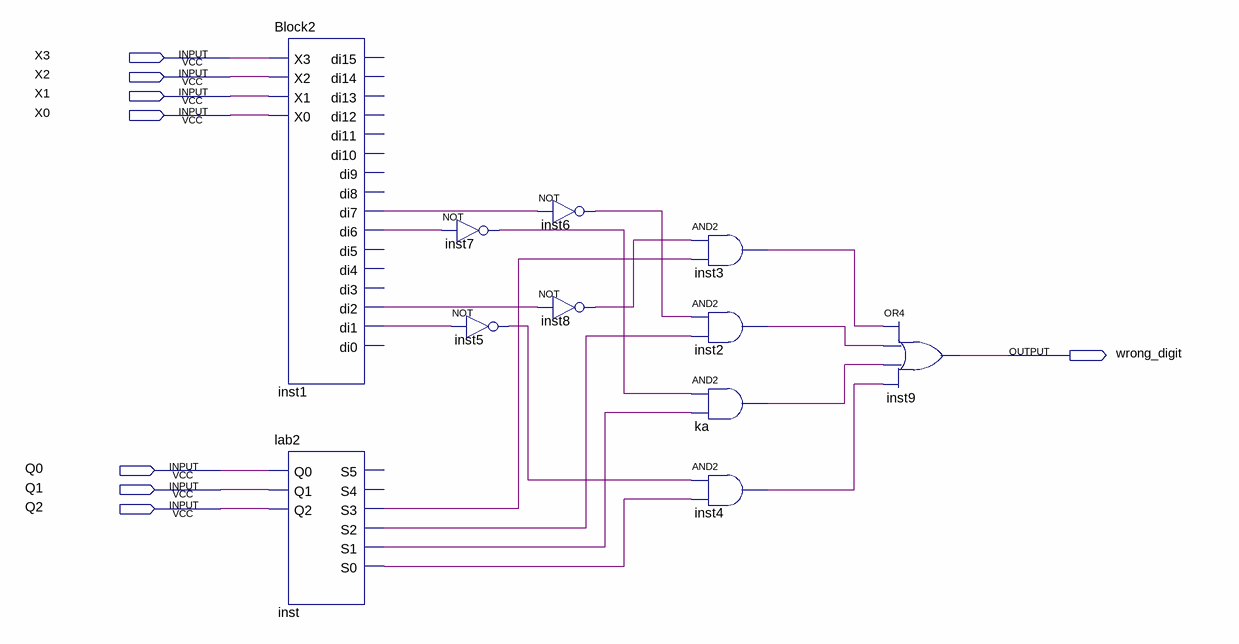
[diagram p0: schematic sheet]
// Quartus schematic Block3.bdf as structural Verilog: 11 symbols, 8 pins
module Block3 (
  input  X3,
  input  X2,
  input  X1,
  input  X0,
  input  Q0,
  input  Q1,
  input  Q2,
  output wrong_digit
);

  wire inst1_di1, inst1_di2, inst1_di6, inst1_di7, inst2_out, inst3_out, inst4_out, inst5_out, inst6_out,
       inst7_out, inst8_out, inst_s0, inst_s1, inst_s2, inst_s3, ka_out;

  Block2 inst1 (
    .X3(X3), .X2(X2), .X1(X1), .X0(X0), .di7(inst1_di7), .di6(inst1_di6), .di2(inst1_di2), .di1(inst1_di1));  // open: di15, di14, di13, di12, di11, di10, di9, di8, di5, di4, di3, di0
  lab2 inst (.Q0(Q0), .Q1(Q1), .Q2(Q2), .S3(inst_s3), .S2(inst_s2), .S1(inst_s1), .S0(inst_s0));  // open: S5, S4
  not inst7 (inst7_out, inst1_di6);
  not inst5 (inst5_out, inst1_di1);
  not inst6 (inst6_out, inst1_di7);
  not inst8 (inst8_out, inst1_di2);
  and inst3 (inst3_out, inst8_out, inst_s3);
  and inst2 (inst2_out, inst6_out, inst_s2);
  and ka (ka_out, inst7_out, inst_s1);
  and inst4 (inst4_out, inst5_out, inst_s0);
  or inst9 (wrong_digit, inst3_out, inst2_out, ka_out, inst4_out);
endmodule
